# Altium project Guppy Buddy Rev B.PrjPCB (part 8 of 9)

## Sheet Power Main Regulators.SchDoc: Main Regulator
size Tabloid; ApprovedBy: NA; CompanyName: Cospan Design LLC; DrawnBy: Dave McCoy; Engineer: Dave McCoy; DocumentNumber: 20; Revision: A; SheetNumber: 20; SheetTotal: 20; Client: Public; Project: Enigma; ProjectPrettyName: Enigma
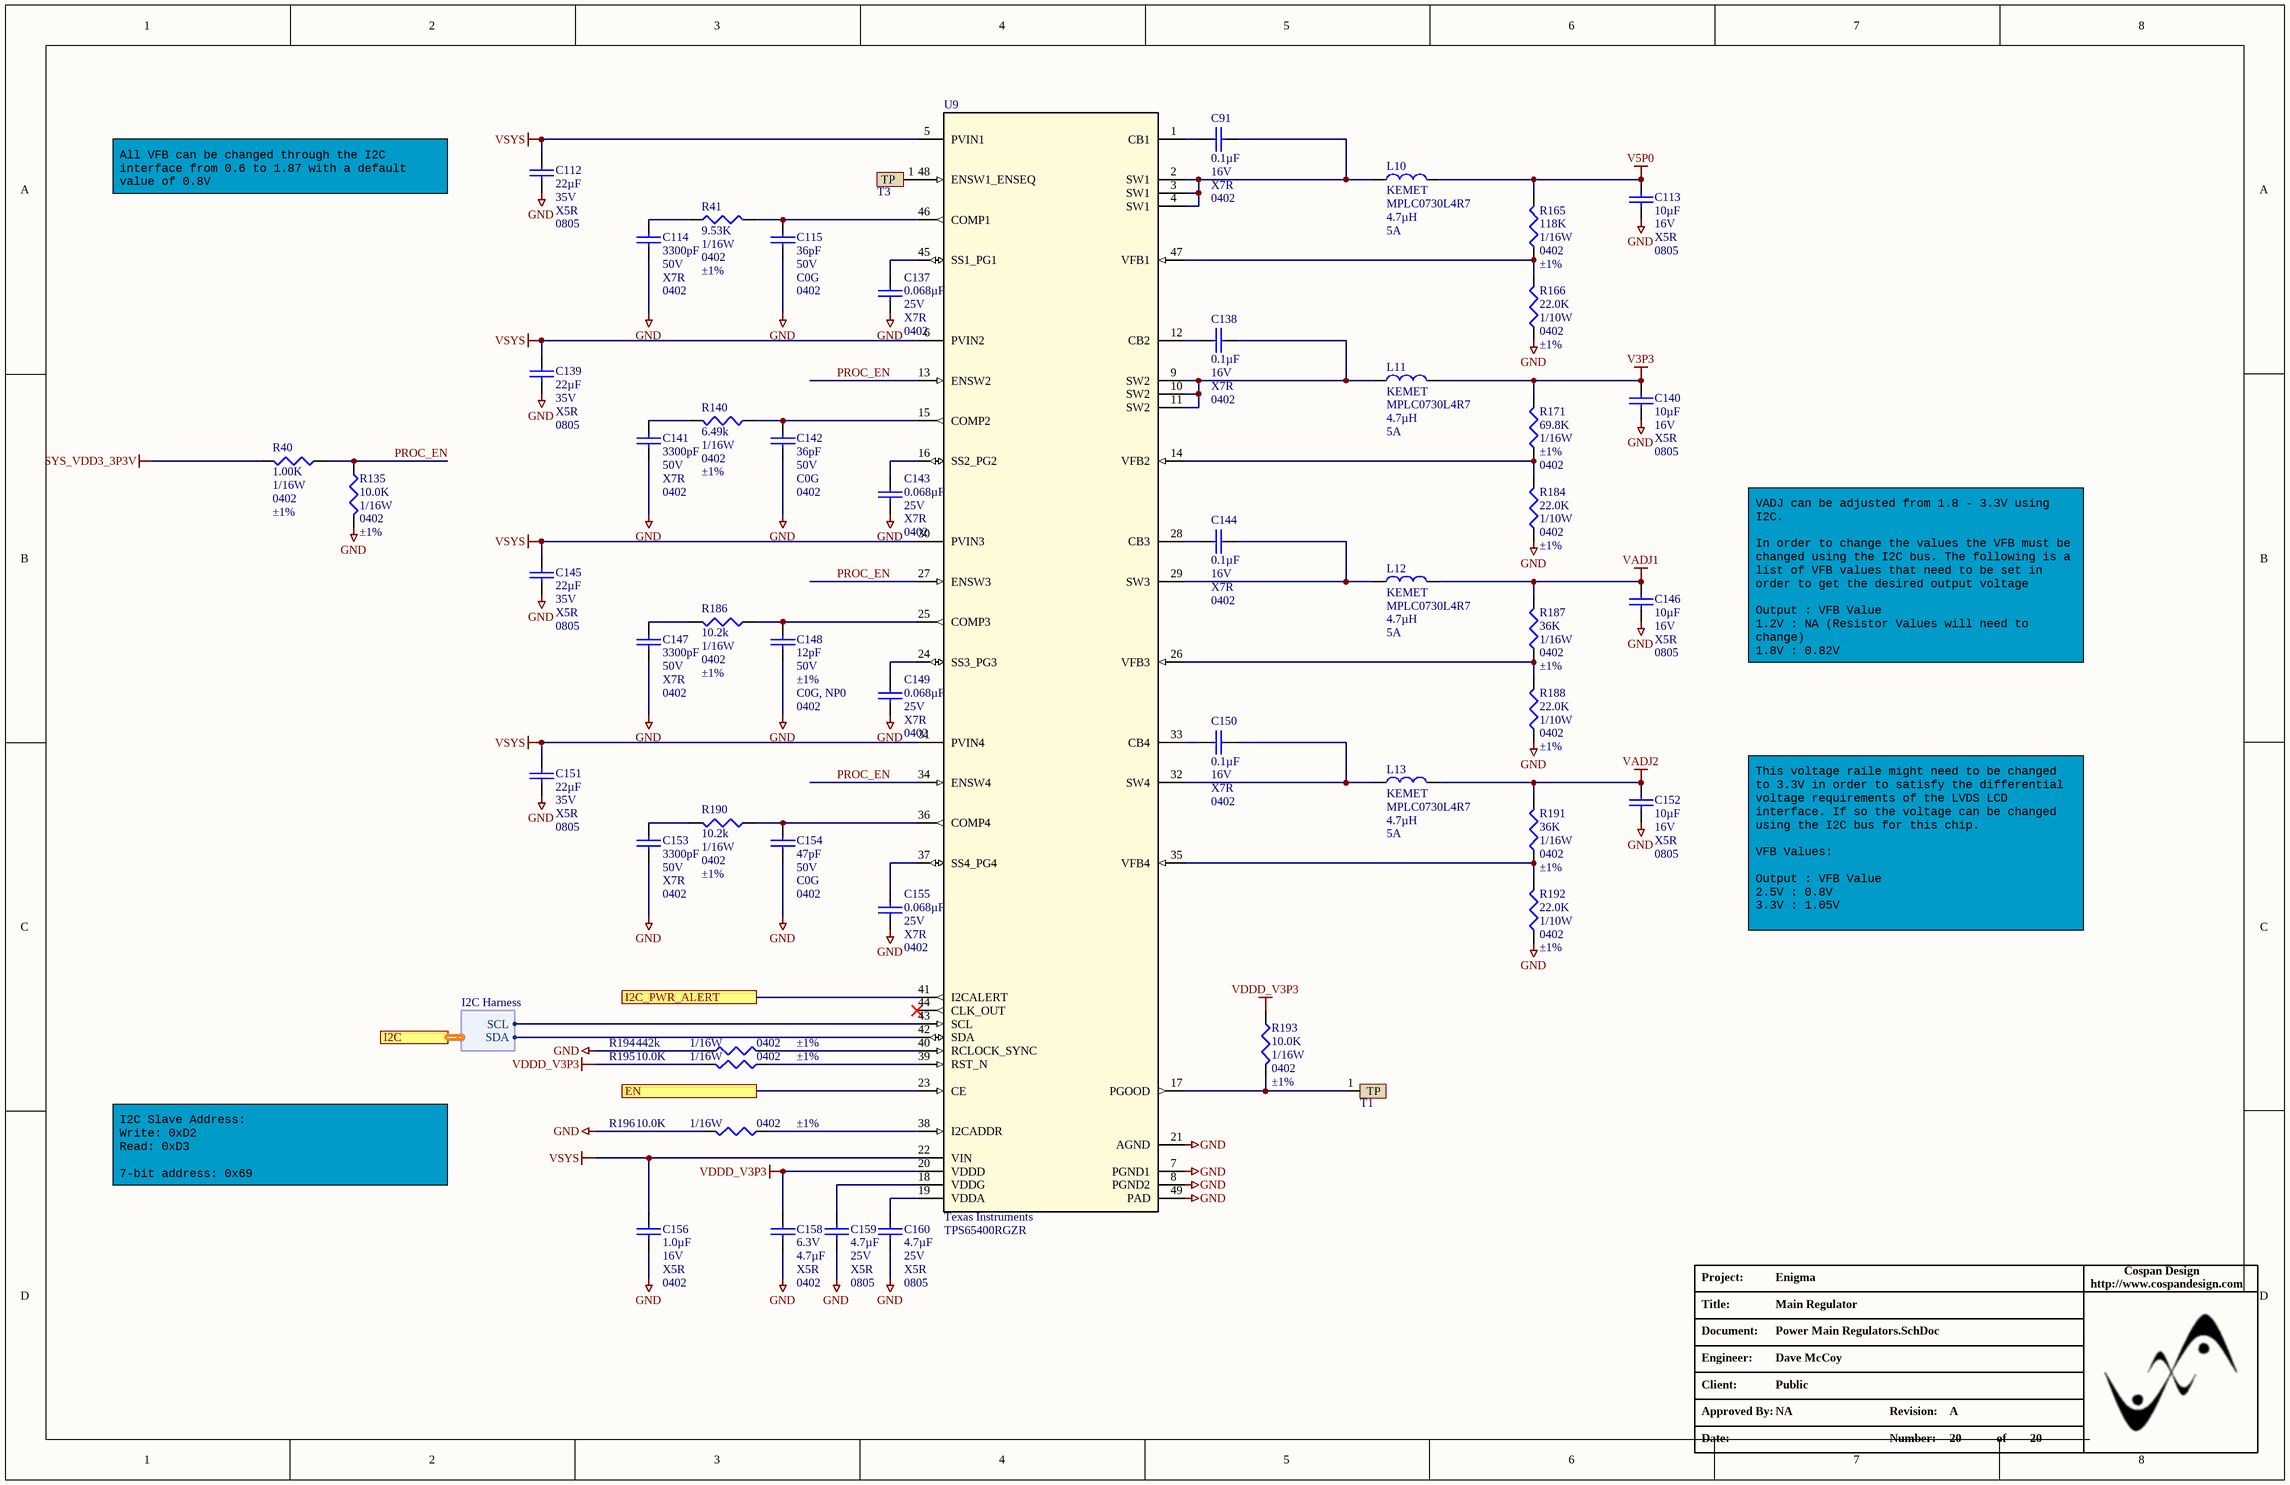
[diagram p14: Power Main Regulators.SchDoc]

### Parts
C91  Capacitance: 0.1µF  Voltage - Rated: 16V  Temperature Coefficient: X7R  Package / Case: 0402  [C_0402]  (hidden comment: 0.1uF)
C112  Capacitance: 22µF  Voltage - Rated: 35V  Temperature Coefficient: X5R  Package / Case: 0805  [C_ERA-0805]  (hidden comment: C_0805_22µF_35V)
C113  Voltage - Rated: 16V  Temperature Coefficient: X5R  Package / Case: 0805  [C_ERA-0805]  (hidden comment: 10µF)
C114  Capacitance: 3300pF  Voltage - Rated: 50V  Temperature Coefficient: X7R  Package / Case: 0402  [C_0402]  (hidden comment: C_0402_3.3nF_50V)
C115  Capacitance: 36pF  Voltage - Rated: 50V  Temperature Coefficient: C0G  Package / Case: 0402  [C_0402]  (hidden comment: C_0402_36pF)
C137  Capacitance: 0.068µF  Voltage - Rated: 25V  Temperature Coefficient: X7R  Package / Case: 0402  [C_0402]  (hidden comment: C_0402_68nF)
C138  Capacitance: 0.1µF  Voltage - Rated: 16V  Temperature Coefficient: X7R  Package / Case: 0402  [C_0402]  (hidden comment: 0.1uF)
C139  Capacitance: 22µF  Voltage - Rated: 35V  Temperature Coefficient: X5R  Package / Case: 0805  [C_ERA-0805]  (hidden comment: C_0805_22µF_35V)
C140  Voltage - Rated: 16V  Temperature Coefficient: X5R  Package / Case: 0805  [C_ERA-0805]  (hidden comment: 10µF)
C141  Capacitance: 3300pF  Voltage - Rated: 50V  Temperature Coefficient: X7R  Package / Case: 0402  [C_0402]  (hidden comment: C_0402_3.3nF_50V)
C142  Capacitance: 36pF  Voltage - Rated: 50V  Temperature Coefficient: C0G  Package / Case: 0402  [C_0402]  (hidden comment: C_0402_36pF)
C143  Capacitance: 0.068µF  Voltage - Rated: 25V  Temperature Coefficient: X7R  Package / Case: 0402  [C_0402]  (hidden comment: C_0402_68nF)
C144  Capacitance: 0.1µF  Voltage - Rated: 16V  Temperature Coefficient: X7R  Package / Case: 0402  [C_0402]  (hidden comment: 0.1uF)
C145  Capacitance: 22µF  Voltage - Rated: 35V  Temperature Coefficient: X5R  Package / Case: 0805  [C_ERA-0805]  (hidden comment: C_0805_22µF_35V)
C146  Voltage - Rated: 16V  Temperature Coefficient: X5R  Package / Case: 0805  [C_ERA-0805]  (hidden comment: 10µF)
C147  Capacitance: 3300pF  Voltage - Rated: 50V  Temperature Coefficient: X7R  Package / Case: 0402  [C_0402]  (hidden comment: C_0402_3.3nF_50V)
C148  Voltage - Rated: 50V  Tolerance: ±1%  Temperature Coefficient: C0G, NP0  Package / Case: 0402  [C_0402]  (hidden comment: 12pF)
C149  Capacitance: 0.068µF  Voltage - Rated: 25V  Temperature Coefficient: X7R  Package / Case: 0402  [C_0402]  (hidden comment: C_0402_68nF)
C150  Capacitance: 0.1µF  Voltage - Rated: 16V  Temperature Coefficient: X7R  Package / Case: 0402  [C_0402]  (hidden comment: 0.1uF)
C151  Capacitance: 22µF  Voltage - Rated: 35V  Temperature Coefficient: X5R  Package / Case: 0805  [C_ERA-0805]  (hidden comment: C_0805_22µF_35V)
C152  Voltage - Rated: 16V  Temperature Coefficient: X5R  Package / Case: 0805  [C_ERA-0805]  (hidden comment: 10µF)
C153  Capacitance: 3300pF  Voltage - Rated: 50V  Temperature Coefficient: X7R  Package / Case: 0402  [C_0402]  (hidden comment: C_0402_3.3nF_50V)
C154  Voltage - Rated: 50V  Temperature Coefficient: C0G  Package / Case: 0402  [C_0402]  (hidden comment: 47pF)
C155  Capacitance: 0.068µF  Voltage - Rated: 25V  Temperature Coefficient: X7R  Package / Case: 0402  [C_0402]  (hidden comment: C_0402_68nF)
C156  Capacitance: 1.0µF  Voltage - Rated: 16V  Temperature Coefficient: X5R  Package / Case: 0402  [C_0402]  (hidden comment: 1.0uF)
C158  Voltage - Rated: 6.3V  Capacitance: 4.7µF  Temperature Coefficient: X5R  Package / Case: 0402  [C_0402]  (hidden comment: 4.7uF)
C159  Voltage - Rated: 25V  Temperature Coefficient: X5R  Package / Case: 0805  [C_ERA-0805]  (hidden comment: 4.7µF)
C160  Voltage - Rated: 25V  Temperature Coefficient: X5R  Package / Case: 0805  [C_ERA-0805]  (hidden comment: 4.7µF)
L10  Manufacturer: KEMET  Manufacturer Part Number: MPLC0730L4R7  Inductance: 4.7µH  Max DC Current: 5A  [KEM_L9004_MPLC]  (hidden comment: L_MPLC0730L4R7)
L11  Manufacturer: KEMET  Manufacturer Part Number: MPLC0730L4R7  Inductance: 4.7µH  Max DC Current: 5A  [KEM_L9004_MPLC]  (hidden comment: L_MPLC0730L4R7)
L12  Manufacturer: KEMET  Manufacturer Part Number: MPLC0730L4R7  Inductance: 4.7µH  Max DC Current: 5A  [KEM_L9004_MPLC]  (hidden comment: L_MPLC0730L4R7)
L13  Manufacturer: KEMET  Manufacturer Part Number: MPLC0730L4R7  Inductance: 4.7µH  Max DC Current: 5A  [KEM_L9004_MPLC]  (hidden comment: L_MPLC0730L4R7)
R40  Resistance In Ohms: 1.00K  Power (Watts): 1/16W  Case: 0402  Tolerance: ±1%  [R_0402]  (hidden comment: 1.0k Ohms)
R41  Resistance In Ohms: 9.53K  Power (Watts): 1/16W  Case: 0402  Tolerance: ±1%  [R_0402]  (hidden comment: R_0402_9.53K)
R135  Resistance In Ohms: 10.0K  Power (Watts): 1/16W  Case: 0402  Tolerance: ±1%  [R_0402]  (hidden comment: R_0402_10.0K)
R140  Resistance In Ohms: 6.49k  Power (Watts): 1/16W  Case: 0402  Tolerance: ±1%  [R_0402]  (hidden comment: R_0402_6.49k)
R165  Resistance In Ohms: 118K  Power (Watts): 1/16W  Case: 0402  Tolerance: ±1%  [R_0402]  (hidden comment: R_0402_118K)
R166  Resistance In Ohms: 22.0K  Power (Watts): 1/10W  Case: 0402  Tolerance: ±1%  [R_0402]  (hidden comment: R_0402_22.0K)
R171  Resistance In Ohms: 69.8K  Power (Watts): 1/16W  Tolerance: ±1%  Case: 0402  [R_0402]  (hidden comment: R_0402_69.8K)
R184  Resistance In Ohms: 22.0K  Power (Watts): 1/10W  Case: 0402  Tolerance: ±1%  [R_0402]  (hidden comment: R_0402_22.0K)
R186  Resistance In Ohms: 10.2k  Power (Watts): 1/16W  Case: 0402  Tolerance: ±1%  [R_0402]  (hidden comment: R_0402_10.2k)
R187  Resistance In Ohms: 36K  Power (Watts): 1/16W  Case: 0402  Tolerance: ±1%  [R_0402]  (hidden comment: R_0402_36.0K)
R188  Resistance In Ohms: 22.0K  Power (Watts): 1/10W  Case: 0402  Tolerance: ±1%  [R_0402]  (hidden comment: R_0402_22.0K)
R190  Resistance In Ohms: 10.2k  Power (Watts): 1/16W  Case: 0402  Tolerance: ±1%  [R_0402]  (hidden comment: R_0402_10.2k)
R191  Resistance In Ohms: 36K  Power (Watts): 1/16W  Case: 0402  Tolerance: ±1%  [R_0402]  (hidden comment: R_0402_36.0K)
R192  Resistance In Ohms: 22.0K  Power (Watts): 1/10W  Case: 0402  Tolerance: ±1%  [R_0402]  (hidden comment: R_0402_22.0K)
R193  Resistance In Ohms: 10.0K  Power (Watts): 1/16W  Case: 0402  Tolerance: ±1%  [R_0402]  (hidden comment: R_0402_10.0K)
R194  Resistance In Ohms: 442k  Power (Watts): 1/16W  Case: 0402  Tolerance: ±1%  [R_0402]  (hidden comment: R_0402_442k)
R195  Resistance In Ohms: 10.0K  Power (Watts): 1/16W  Case: 0402  Tolerance: ±1%  [R_0402]  (hidden comment: R_0402_10.0K)
R196  Resistance In Ohms: 10.0K  Power (Watts): 1/16W  Case: 0402  Tolerance: ±1%  [R_0402]  (hidden comment: R_0402_10.0K)
T1  TEST_POINT_SMALL  [TestPointSmall]  (value not drawn)  (no BOM)
T3  TEST_POINT_SMALL  [TestPointSmall]  (value not drawn)  (no BOM)
U9  Manufacturer: Texas Instruments  Manufacturer Part Number: TPS65400RGZR  [RGZ0048B]  (hidden comment: U_TPS65400RGZR)

### Ports
EN, I2C (harness I2C Harness), I2C_PWR_ALERT

### Harnesses
I2C Harness: SCL, SDA

### Nets
GND: C112.1 C113.1 C114.1 C115.1 C137.1 C139.1 C140.1 C141.1 C142.1 C143.1 C145.1 C146.1 C147.1 C148.1 C149.1 C151.1 C152.1 C153.1 C154.1 C155.1 C156.1 C158.1 C159.1 C160.1 R135.1 R166.2 R184.2 R188.2 R192.2 R194.2 R196.1 U9.7(PGND1) U9.8(PGND2) U9.21(AGND) U9.49(PAD)
SYS_VDD3_3P3V: R40.1
V3P3: C140.2 L11.1 R171.1
V5P0: C113.2 L10.1 R165.1
VADJ1: C146.2 L12.1 R187.1
VADJ2: C152.2 L13.1 R191.1
VDDD_V3P3: C158.2 R193.2 R195.1 U9.20(VDDD)
VSYS: C112.2 C139.2 C145.2 C151.2 C156.2 U9.5(PVIN1) U9.6(PVIN2) U9.22(VIN) U9.30(PVIN3) U9.31(PVIN4)
I2C1_SCL: U9.43(SCL) ; port I2C.SCL
I2C1_SDA: U9.42(SDA) ; port I2C.SDA
I2C_PWR_ALERT: U9.41(I2CALERT) ; port I2C_PWR_ALERT
PROC_EN: R40.2 R135.2 U9.13(ENSW2) U9.27(ENSW3) U9.34(ENSW4)
PWR_ON: U9.23(CE) ; port EN
NetC91_1: C91.1 L10.2 U9.2(SW1) U9.3(SW1) U9.4(SW1)
NetC91_2: C91.2 U9.1(CB1)
NetC114_2: C114.2 R41.2
NetC115_2: C115.2 R41.1 U9.46(COMP1)
NetC137_2: C137.2 U9.45(SS1_PG1)
NetC138_1: C138.1 L11.2 U9.9(SW2) U9.10(SW2) U9.11(SW2)
NetC138_2: C138.2 U9.12(CB2)
NetC141_2: C141.2 R140.1
NetC142_2: C142.2 R140.2 U9.15(COMP2)
NetC143_2: C143.2 U9.16(SS2_PG2)
NetC144_1: C144.1 L12.2 U9.29(SW3)
NetC144_2: C144.2 U9.28(CB3)
NetC147_2: C147.2 R186.1
NetC148_2: C148.2 R186.2 U9.25(COMP3)
NetC149_2: C149.2 U9.24(SS3_PG3)
NetC150_1: C150.1 L13.2 U9.32(SW4)
NetC150_2: C150.2 U9.33(CB4)
NetC153_2: C153.2 R190.1
NetC154_2: C154.2 R190.2 U9.36(COMP4)
NetC155_2: C155.2 U9.37(SS4_PG4)
NetC159_2: C159.2 U9.18(VDDG)
NetC160_2: C160.2 U9.19(VDDA)
NetR165_2: R165.2 R166.1 U9.47(VFB1)
NetR171_2: R171.2 R184.1 U9.14(VFB2)
NetR187_2: R187.2 R188.1 U9.26(VFB3)
NetR191_2: R191.2 R192.1 U9.35(VFB4)
NetR193_1: R193.1 T1.1(TP) U9.17(PGOOD)
NetR194_1: R194.1 U9.40(RCLOCK_SYNC)
NetR195_2: R195.2 U9.39(RST_N)
NetR196_2: R196.2 U9.38(I2CADDR)
NetT3_1: T3.1(TP) U9.48(ENSW1_ENSEQ)

Not connected (* = marked no-connect by the designer): U9 44(CLK_OUT)*

### Notes on the sheet
- All VFB can be changed through the I2C interface from 0.6 to 1.87 with a default value of 0.8V
- VADJ can be adjusted from 1.8 - 3.3V using I2C.
  In order to change the values the VFB must be changed using the I2C bus. The following is a list of VFB values that need to be set in order to get the desired output voltage
  Output	: VFB Value
  1.2V	: NA (Resistor Values will need to change)
  1.8V	: 0.82V
  2.5V	: 1.14V
  3.3V	: 1.51V
- This voltage raile might need to be changed to 3.3V in order to satisfy the differential voltage requirements of the LVDS LCD interface. If so the voltage can be changed using the I2C bus for this chip.
  VFB Values:
  Output	: VFB Value
  2.5V	: 0.8V
  3.3V	: 1.05V
- I2C Slave Address:
  Write: 0xD2
  Read: 0xD3
  7-bit address: 0x69
- Project:
- http://www.cospandesign.com
- Cospan Design
- Document:
- Engineer:
- Title:
- Client:
- Approved By:
- Revision:
- Date:
- Number:
- of

### Library data of the parts
C91 C138 C144 C150 = C_0402_0.1UF_16V: CAP CER .10UF 16V X7R 0402; Manufacturer: Murata Electronics North America; Manufacturer Part Number: GRM155R71C104KA88J; Tolerance: ±10%; Supplier 1: Digi-Key; RoHS: RoHS Compliant; Category: Capacitors; Stock 1: 18103134; Pricing 1: 1=0.1, 10=0.014, 100=0.0062, 500=0.00442, 1000=0.00348, 2500=0.00316, 5000=0.00291 (USD); Packaging: Cut Tape (CT); Part Status: Active; Operating Temperature: -55°C ~ 125°C; Features: -; Ratings: -; Applications: General Purpose; Mounting Type: Surface Mount, MLCC; Size / Dimension: 0.039" L x 0.020" W (1.00mm x 0.50mm); Height - Seated (Max): -; Thickness (Max): 0.022" (0.55mm); Lead Spacing: -; ComponentLink1URL: http://www.murata.com/~/media/webrenewal/support/library/catalog/products/capacitor/mlcc/c02e.ashx?la=en-us; ComponentLink1Description: http://www.murata.com/~/media/webrenewal/support/library/catalog/products/capacitor/mlcc/c02e.ashx?la=en-us; Supplier Part Number 1: 490-6328-1-ND
C112 C139 C145 C151 = C_0805_22µF_35V: CAP CER 22UF 35V X5R 0805; Manufacturer: TDK Corporation; Manufacturer Part Number: C2012X5R1V226M125AC; Tolerance: ±20%; Supplier 1: Digi-Key; RoHS: RoHS Compliant; Category: Capacitors; Stock 1: 3681; Pricing 1: 1=1.14, 10=0.863, 100=0.6176, 500=0.47818, 1000=0.41176 (USD); Packaging: Cut Tape (CT); Mounting Type: Surface Mount, MLCC; Operating Temperature: -55°C ~ 85°C; Applications: General Purpose; Ratings: -; Size / Dimension: 0.079" L x 0.049" W (2.00mm x 1.25mm); Height - Seated (Max): -; Thickness (Max): 0.057" (1.45mm); Lead Spacing: -; Features: Low ESL; Lead Style: -; ComponentLink1URL: https://product.tdk.com/info/en/catalog/datasheets/mlcc_commercial_general_en.pdf; ComponentLink1Description: https://product.tdk.com/info/en/catalog/datasheets/mlcc_commercial_general_en.pdf; Supplier Part Number 1: 445-14428-1-ND; Part Status: Active; Failure Rate: -
C113 C140 C146 C152 = C_0805_10UF_16V: CAP CER 10uF 16V X5R 20% 0805; Manufacturer: Taiyo Yuden; Manufacturer Part Number: EMK212BJ106KG-T; Tolerance: ±10%; Supplier 1: Digi-Key; Supplier Part Number 1: 587-1295-1-ND; Category: Capacitors; Stock 1: 2052124; Capacitance: 10µF; RoHS: RoHS Compliant; Pricing 1: 1=0.2, 10=0.139, 100=0.0656, 500=0.04596, 1000=0.03805 (USD); Packaging: Cut Tape (CT); Part Status: Active; Operating Temperature: -55°C ~ 85°C; Features: -; Ratings: -; Applications: General Purpose; Mounting Type: Surface Mount, MLCC; Size / Dimension: 0.079" L x 0.049" W (2.00mm x 1.25mm); Height - Seated (Max): -; Thickness (Max): 0.053" (1.35mm); Lead Spacing: -; Lead Style: -; ComponentLink1URL: http://www.yuden.co.jp/productdata/catalog/en/mlcc01_e.pdf; ComponentLink1Description: http://www.yuden.co.jp/productdata/catalog/en/mlcc01_e.pdf
C114 C141 C147 C153 = C_0402_3.3nF_50V: Manufacturer: Murata Electronics North America; Manufacturer Part Number: GRM155R71H332KA01D; Tolerance: ±10%; Supplier 1: Digi-Key; Supplier Part Number 1: 490-3248-1-ND; RoHS: RoHS Compliant; Category: Capacitors; Stock 1: 717319; Mounting Type: Surface Mount, MLCC; Operating Temperature: -55°C ~ 125°C; Applications: General Purpose; Size / Dimension: 0.039" L x 0.020" W (1.00mm x 0.50mm); Thickness (Max): 0.022" (0.55mm); Packaging: Cut Tape (CT); ComponentLink1URL: http://www.murata.com/~/media/webrenewal/support/library/catalog/products/capacitor/mlcc/c02e.ashx?la=en-us; ComponentLink1Description: http://www.murata.com/~/media/webrenewal/support/library/catalog/products/capacitor/mlcc/c02e.ashx?la=en-us; Pricing 1: 1=0.1, 10=0.013, 100=0.0059, 500=0.0042, 1000=0.0033, 2500=0.003, 5000=0.00276 (USD); Part Status: Active; Features: -; Ratings: -; Height - Seated (Max): -; Lead Spacing: -; Lead Style: -
C115 C142 = C_0402_36pF: CAP CER 36PF 50V NP0 0402; Manufacturer: Samsung Electro-Mechanics America, Inc.; Manufacturer Part Number: CL05C360JB5NNNC; Tolerance: ±5%; Supplier 1: Digi-Key; RoHS: RoHS Compliant; Category: Capacitors; Stock 1: 24626; Pricing 1: 1=0.1, 10=0.03, 25=0.0208, 50=0.016, 100=0.0135, 500=0.00948, 1000=0.00738, 5000=0.00615 (USD); Packaging: Cut Tape (CT); Mounting Type: Surface Mount, MLCC; Operating Temperature: -55°C ~ 125°C; Applications: General Purpose; Ratings: -; Size / Dimension: 0.039" L x 0.020" W (1.00mm x 0.50mm); Height - Seated (Max): -; Thickness (Max): 0.022" (0.55mm); Lead Spacing: -; Features: -; Lead Style: -; ComponentLink1URL: http://www.samsungsem.com/kr/support/product-search/mlcc/CL05C360JB5NNNC.jsp; ComponentLink1Description: http://www.samsungsem.com/kr/support/product-search/mlcc/CL05C360JB5NNNC.jsp; Supplier Part Number 1: 1276-1686-1-ND
C137 C143 C149 C155 = C_0402_68nF: CAP CER 0.068UF 25V X7R 0402; Manufacturer: Murata Electronics North America; Manufacturer Part Number: GRM155R71E683KE14D; Tolerance: ±10%; Supplier 1: Digi-Key; RoHS: RoHS Compliant; Category: Capacitors; Stock 1: 7620; Pricing 1: 1=0.1, 10=0.031, 100=0.0136, 500=0.00974, 1000=0.00765, 2500=0.00696, 5000=0.0064 (USD); Packaging: Cut Tape (CT); Part Status: Active; Operating Temperature: -55°C ~ 125°C; Features: -; Ratings: -; Applications: General Purpose; Failure Rate: -; Mounting Type: Surface Mount, MLCC; Size / Dimension: 0.039" L x 0.020" W (1.00mm x 0.50mm); Height - Seated (Max): -; Thickness (Max): 0.022" (0.55mm); Lead Spacing: -; Lead Style: -; ComponentLink1URL: http://search.murata.co.jp/Ceramy/image/img/A01X/G101/ENG/GRM155R71E683KE14-01.pdf; ComponentLink1Description: http://search.murata.co.jp/Ceramy/image/img/A01X/G101/ENG/GRM155R71E683KE14-01.pdf; Supplier Part Number 1: 490-14604-1-ND
C148 = C_0402_12PF_50V: CAP CER 12PF 50V 5% C0G 0402; Manufacturer: Murata Electronics North America; Manufacturer Part Number: GRM1555C1H120FA01D; Supplier 1: Digi-Key; Supplier Part Number 1: 490-6196-1-ND; RoHS: RoHS Compliant; Category: Capacitors; Stock 1: 386052; Mounting Type: Surface Mount, MLCC; Operating Temperature: -55°C ~ 125°C; Applications: General Purpose; Ratings: -; Size / Dimension: 0.039" L x 0.020" W (1.00mm x 0.50mm); Lead Spacing: -; Features: -; Packaging: Cut Tape (CT); Lead Style: -; ComponentLink1URL: http://search.murata.co.jp/Ceramy/image/img/A01X/G101/ENG/GRM1555C1H120FA01-01.pdf; ComponentLink1Description: http://search.murata.co.jp/Ceramy/image/img/A01X/G101/ENG/GRM1555C1H120FA01-01.pdf; Capacitance: 12pF; Pricing 1: 1=0.1, 10=0.05, 100=0.0223, 500=0.01594, 1000=0.01252, 2500=0.01138, 5000=0.01047 (USD); Part Status: Active; Height - Seated (Max): -; Thickness (Max): 0.022" (0.55mm)
C154 = C_0402_47p_50V: CAP CER 47PF 50V 5% C0G 0402; Manufacturer: Murata Electronics North America; Manufacturer Part Number: GRM1555C1H470JA01D; Supplier 1: Digi-Key; RoHS: RoHS Compliant; Category: Capacitors; Stock 1: 682755; Pricing 1: 1=0.1, 10=0.013, 50=0.007, 100=0.0059, 250=0.00488, 500=0.00416, 1000=0.00324, 5000=0.0027 (USD); Packaging: Cut Tape (CT); Tolerance: ±5%; Mounting Type: Surface Mount, MLCC; Operating Temperature: -55°C ~ 125°C; Applications: General Purpose; Ratings: -; Size / Dimension: 0.039" L x 0.020" W (1.00mm x 0.50mm); Height - Seated (Max): -; Thickness (Max): 0.022" (0.55mm); Lead Spacing: -; Features: -; Lead Style: -; ComponentLink1URL: http://www.murata.com/~/media/webrenewal/support/library/catalog/products/capacitor/mlcc/c02e.ashx; ComponentLink1Description: http://www.murata.com/~/media/webrenewal/support/library/catalog/products/capacitor/mlcc/c02e.ashx; Supplier Part Number 1: 490-5942-1-ND; Capacitance: 47pF
C156 = C_0402_1.0UF_16V: CAP CER 1.0UF 16V X5R 0402; Manufacturer 1: Samsung; Manufacturer Part Number 1: CL05A105KO5NNNC; Description 1: Cap Ceramic 1uF 16V X5R 10% SMD 0402 85C Paper T/R; Tolerance: 10%; ComponentLink1URL: http://ds.yuden.co.jp/TYCOMPAS/ut/detail.do?productNo=EMK105BJ105KV-F&fileName=EMK105BJ105KV-F_SS&mode=specSheetDownload; ComponentLink1Description: http://ds.yuden.co.jp/TYCOMPAS/ut/detail.do?productNo=EMK105BJ105KV-F&fileName=EMK105BJ105KV-F_SS&mode=specSheetDownload; ComponentLink2URL: https://datasheet.ciiva.com/16207/cl05a105ko5nnnc-16207571.pdf; ComponentLink2Description: https://datasheet.ciiva.com/16207/cl05a105ko5nnnc-16207571.pdf; ComponentLink3URL: https://datasheet.ciiva.com/15195/getdatasheetpartid-355272-15195629.pdf; ComponentLink3Description: https://datasheet.ciiva.com/15195/getdatasheetpartid-355272-15195629.pdf; Supplier 1: Digi-Key; Supplier Part Number 1: 1276-1067-6-ND; Stock 1: 26908; Pricing 1: 1=0.1, 10=0.062, 100=0.0276, 500=0.01968, 1000=0.01547, 2500=0.01406, 5000=0.01294 (USD); Mount: Surface Mount; Case/Package: 0402; Case Code (Metric): 1005; Case Code (Imperial): 0402; Contact Plating: Tin; Min Operating Temperature: -55°C; Max Operating Temperature: 85°C; Dielectric: X5R; Packaging: Tape and Reel; Package Quantity: 1; Voltage Rating: 16V; Voltage: 16V; Length: 1mm; Height: 0.5mm; Width: 0.02inch; Thickness: 0.022inch; Depth: 0.5mm; Radiation Hardening: No
C158 = C_0402_4.7UF: CAP CER 4.7UF 6.3V X5R 0402; Manufacturer: Samsung Electro-Mechanics America, Inc; Manufacturer Part Number: CL05A475MQ5NRNC; Tolerance: ±20%; Supplier 1: Digi-Key; Supplier Part Number 1: 1276-1056-1-ND; RoHS: RoHS Compliant; Category: Capacitors; Stock 1: 318619; Pricing: 1=0.23, 10=0.159, 25=0.116, 50=0.0966, 100=0.0811, 250=0.06564, 500=0.0579, 1000=0.04922, 2500=0.04536 (USD); Packaging: Cut Tape (CT); Mounting Type: Surface Mount, MLCC; Operating Temperature: -55°C ~ 85°C; Applications: General Purpose; Ratings: -; Size / Dimension: 0.039" L x 0.020" W (1.00mm x 0.50mm); Height - Seated (Max): -; Thickness (Max): 0.022" (0.55mm); Lead Spacing: -; Features: -; Lead Style: -; ComponentLink1URL: http://www.samsungsem.com/servlet/FileDownload?type=spec&file=CL05A475MQ5NRNC.pdf; ComponentLink1Description: http://www.samsungsem.com/servlet/FileDownload?type=spec&file=CL05A475MQ5NRNC.pdf
C159 C160 = C_0805_4.7µF_25V: CAP CER 4.7UF 25V 10% X5R 0805; Manufacturer: Taiyo Yuden; Manufacturer Part Number: TMK212BJ475KG-T; Supplier 1: Digi-Key; RoHS: RoHS Compliant; Category: Capacitors; Stock 1: 38955; Pricing 1: 1=0.24, 10=0.2, 50=0.1126, 100=0.1, 250=0.075, 500=0.06626, 1000=0.05875 (USD); Tolerance: ±10%; Mounting Type: Surface Mount, MLCC; Operating Temperature: -55°C ~ 85°C; Applications: General Purpose; Ratings: -; Size / Dimension: 0.079" L x 0.049" W (2.00mm x 1.25mm); Height - Seated (Max): -; Thickness (Max): 0.053" (1.35mm); Lead Spacing: -; Features: -; Packaging: Cut Tape (CT); Lead Style: -; ComponentLink1URL: http://www.yuden.co.jp/productdata/catalog/en/mlcc01_e.pdf; ComponentLink1Description: http://www.yuden.co.jp/productdata/catalog/en/mlcc01_e.pdf; Supplier Part Number 1: 587-1782-1-ND; Capacitance: 4.7µF
L10-L13 = L_MPLC0730L4R7: FIXED IND 4.7UH 5A 41 MOHM SMD; Type: Wirewound; Tolerance: ±20%; Shielding: Shielded; DC Resistance (DCR): 41 mOhm Max; Supplier 1: Digi-Key; RoHS: RoHS Compliant; Category: Inductors, Coils, Chokes; Stock 1: 3443; Pricing 1: 1=0.9, 10=0.837, 25=0.7728, 50=0.644, 100=0.6054, 250=0.54096, 500=0.46368 (USD); Packaging: Cut Tape (CT); Part Status: Active; Material - Core: -; Q @ Freq: -; Ratings: -; Operating Temperature: -20°C ~ 120°C; Mounting Type: Surface Mount; Package / Case: 2-SMD, J-Lead; Supplier Device Package: -; Size / Dimension: 0.303" L x 0.264" W (7.70mm x 6.70mm); Height - Seated (Max): 0.118" (3.00mm); ComponentLink1URL: https://search.kemet.com/component-edge/download/datasheet/MPLC0730L4R7.pdf; ComponentLink1Description: https://search.kemet.com/component-edge/download/datasheet/MPLC0730L4R7.pdf; Supplier Part Number 1: 399-10992-1-ND
R40 = R_0402_1.0K: RES 1.00K OHM 1/16W 1% 0402 SMD; Manufacturer: Yageo; Manufacturer Part Number: RC0402FR-071KL; Resistance (Ohms): 1K; Temperature Coefficient: ±100ppm/°C; Supplier 1: Digi-Key; Supplier Part Number 1: 311-1.00KLRCT-ND; RoHS: RoHS Compliant; Category: Resistors; Stock 1: 2103351; Pricing: 10=0.014, 100=0.0063, 500=0.00382, 1000=0.0027, 5000=0.00203 (USD); Composition: Thick Film; Features: -; Package / Case: 0402 (1005 Metric); Size / Dimension: 0.039" L x 0.020" W (1.00mm x 0.50mm); Height: 0.016" (0.40mm); Number of Terminations: 2; Packaging: Cut Tape (CT); ComponentLink1URL: http://www.yageo.com/documents/recent/PYu-RC0402_51_RoHS_L_6.pdf; ComponentLink1Description: http://www.yageo.com/documents/recent/PYu-RC0402_51_RoHS_L_6.pdf
R41 = R_0402_9.53K: RES SMD 9.53K OHM 1% 1/16W 0402; Manufacturer: Yageo; Manufacturer Part Number: RC0402FR-079K53L; Temperature Coefficient: ±100ppm/°C; Supplier 1: Digi-Key; RoHS: RoHS Compliant; Category: Resistors; Stock 1: 234095; Pricing 1: 1=0.1, 10=0.013, 25=0.0096, 100=0.0054, 250=0.00412, 500=0.00328, 1000=0.00242, 2500=0.0021, 5000=0.00173 (USD); Packaging: Cut Tape (CT); Part Status: Active; Resistance (Ohms): 9.53k; Composition: Thick Film; Features: Moisture Resistant; Operating Temperature: -55°C ~ 155°C; Package / Case: 0402 (1005 Metric); Supplier Device Package: 0402; Size / Dimension: 0.039" L x 0.020" W (1.00mm x 0.50mm); Height: 0.016" (0.40mm); Number of Terminations: 2; ComponentLink1URL: http://www.yageo.com/documents/recent/PYu-RC_Group_51_RoHS_L_04.pdf; ComponentLink1Description: http://www.yageo.com/documents/recent/PYu-RC_Group_51_RoHS_L_04.pdf; Supplier Part Number 1: 311-9.53KLRCT-ND
R135 R193 R195 R196 = R_0402_10.0K: as R104-R106 on sheet LCD; Supplier 1: Digi-Key; Supplier Part Number 1: RMCF0402FT10K0CT-ND; RoHS: RoHS Compliant; Category: Resistors; Stock 1: 234525; Pricing: 1=0.04, 10=0.025, 50=0.0138, 100=0.0105, 250=0.0078, 500=0.00576, 1000=0.00384, 2500=0.00324, 5000=0.0027 (USD); Composition: Thick Film; Features: -; Package / Case: 0402 (1005 Metric); Size / Dimension: 0.039" L x 0.020" W (1.00mm x 0.50mm); Height: 0.016" (0.40mm); Number of Terminations: 2; Packaging: Cut Tape (CT); ComponentLink1URL: http://www.seielect.com/Catalog/SEI-RMCF_RMCP.pdf; ComponentLink1Description: http://www.seielect.com/Catalog/SEI-RMCF_RMCP.pdf
R140 = R_0402_6.49k: RES SMD 6.49K OHM 1% 1/16W 0402; Manufacturer: Samsung Electro-Mechanics America, Inc.; Manufacturer Part Number: RC1005F6491CS; Temperature Coefficient: ±100ppm/°C; Supplier 1: Digi-Key; RoHS: RoHS Compliant; Category: Resistors; Stock 1: 45311; Pricing 1: 1=0.1, 10=0.013, 25=0.0096, 50=0.0074, 100=0.0054, 250=0.00412, 500=0.00328, 1000=0.00242, 2500=0.0021 (USD); Packaging: Cut Tape (CT); Resistance (Ohms): 6.49k; Composition: Thick Film; Features: -; Operating Temperature: -55°C ~ 155°C; Package / Case: 0402 (1005 Metric); Supplier Device Package: 0402 (1005 Metric); Size / Dimension: 0.039" L x 0.020" W (1.00mm x 0.50mm); Height: 0.016" (0.40mm); Number of Terminations: 2; ComponentLink1URL: http://media.digikey.com/pdf/Data%20Sheets/Samsung%20PDFs/RC_Series_ds.pdf; ComponentLink1Description: http://media.digikey.com/pdf/Data%20Sheets/Samsung%20PDFs/RC_Series_ds.pdf; Supplier Part Number 1: 1276-4096-1-ND
R165 = R_0402_118K: RES SMD 118K OHM 1% 1/16W 0402; Manufacturer: Stackpole Electronics Inc; Manufacturer Part Number: RMCF0402FT118K; Temperature Coefficient: ±100ppm/°C; Supplier 1: Digi-Key; RoHS: RoHS Compliant; Category: Resistors; Stock 1: 43108; Pricing 1: 1=0.1, 10=0.025, 50=0.0138, 100=0.0105, 250=0.0078, 500=0.00576, 1000=0.00384, 2500=0.00324, 5000=0.0027 (USD); Packaging: Cut Tape (CT); Resistance (Ohms): 118k; Composition: Thick Film; Features: Automotive AEC-Q200; Operating Temperature: -55°C ~ 155°C; Package / Case: 0402 (1005 Metric); Supplier Device Package: 0402; Size / Dimension: 0.039" L x 0.020" W (1.00mm x 0.50mm); Height: 0.016" (0.40mm); Number of Terminations: 2; ComponentLink1URL: http://www.seielect.com/Catalog/SEI-RMCF_RMCP.pdf; ComponentLink1Description: http://www.seielect.com/Catalog/SEI-RMCF_RMCP.pdf; Supplier Part Number 1: RMCF0402FT118KCT-ND
R166 R184 R188 R192 = R_0402_22.0K: RES 22.0K OHM 1/10W 1% 0402 SMD; Manufacturer: Vishay Dale; Manufacturer Part Number: CRCW040222K0FKED; Resistance (Ohms): 22k; Temperature Coefficient: ±100ppm/°C; Supplier 1: Digi-Key; Supplier Part Number 1: 541-22.0KLCT-ND; RoHS: RoHS Compliant; Category: Resistors; Stock 1: 15892; Pricing: 10=0.083, 50=0.0444, 200=0.0255, 1000=0.0174 (USD); Composition: Thick Film; Features: -; Package / Case: 0402 (1005 Metric); Size / Dimension: 0.039" L x 0.020" W (1.00mm x 0.50mm); Height: 0.016" (0.40mm); Number of Terminations: 2; Packaging: Cut Tape (CT); ComponentLink1URL: http://www.vishay.com/doc?20035; ComponentLink1Description: http://www.vishay.com/doc?20035
R171 = R_0402_69.8K: RES 69.8K OHM 1/16W 1% 0402 SMD; Manufacturer: Yageo; Manufacturer Part Number: RC0402FR-0769K8L; Temperature Coefficient: ±100ppm/°C; Supplier 1: Digi-Key; Supplier Part Number 1: YAG3216CT-ND; RoHS: RoHS Compliant; Category: Resistors; Stock 1: 160383; Composition: Thick Film; Features: Moisture Resistant; Package / Case: 0402 (1005 Metric); Size / Dimension: 0.039" L x 0.020" W (1.00mm x 0.50mm); Packaging: Cut Tape (CT); ComponentLink1URL: http://www.yageo.com/documents/recent/PYu-RC_Group_51_RoHS_L_7.pdf; ComponentLink1Description: http://www.yageo.com/documents/recent/PYu-RC_Group_51_RoHS_L_7.pdf; Pricing 1: 1=0.1, 10=0.014, 100=0.0055, 1000=0.00247, 2500=0.00214, 5000=0.00177 (USD); Part Status: Active; Operating Temperature: -55°C ~ 155°C; Supplier Device Package: 0402; Height - Seated (Max): 0.016" (0.40mm); Failure Rate: -
R186 R190 = R_0402_10.2k: RES SMD 10.2K OHM 1% 1/16W 0402; Manufacturer: Stackpole Electronics Inc.; Manufacturer Part Number: RMCF0402FT10K2; Temperature Coefficient: ±100ppm/°C; Supplier 1: Digi-Key; RoHS: RoHS Compliant; Category: Resistors; Stock 1: 69477; Pricing 1: 1=0.1, 10=0.019, 50=0.0106, 100=0.0078, 250=0.00596, 500=0.00476, 1000=0.0035, 2500=0.00304, 5000=0.00251 (USD); Packaging: Cut Tape (CT); Resistance (Ohms): 10.2k; Composition: Thick Film; Features: Automotive AEC-Q200; Operating Temperature: -55°C ~ 155°C; Package / Case: 0402 (1005 Metric); Supplier Device Package: 0402; Size / Dimension: 0.039" L x 0.020" W (1.00mm x 0.50mm); Height: 0.016" (0.40mm); Number of Terminations: 2; ComponentLink1URL: http://www.seielect.com/Catalog/SEI-RMCF_RMCP.pdf; ComponentLink1Description: http://www.seielect.com/Catalog/SEI-RMCF_RMCP.pdf; Supplier Part Number 1: RMCF0402FT10K2CT-ND
R187 R191 = R_0402_36.0K: RES 36.0K OHM 1/10W 1% 0402 SMD; Manufacturer: Panasonic - ECG; Manufacturer Part Number: ERJ-2RKF3602X; Temperature Coefficient: ±100ppm/°C; Supplier 1: Digi-Key; Supplier Part Number 1: P36.0KLCT-ND; RoHS: RoHS Compliant; Category: Resistors; Stock 1: 39656; Pricing: 1=0.06, 50=0.0242, 100=0.0184, 250=0.01364, 500=0.01008, 1000=0.00672, 5000=0.00473 (USD); Resistance (Ohms): 36K; Composition: Thick Film; Features: -; Size / Dimension: 0.039" L x 0.020" W (1.00mm x 0.50mm); Height: 0.016" (0.40mm); Number of Terminations: 2; Packaging: Cut Tape (CT); Package / Case: 0402 (1005 Metric); ComponentLink1URL: http://industrial.panasonic.com/www-cgi/jvcr13pz.cgi?E+PZ+3+AOA0002+ERJ2RKF3602X+7+WW; ComponentLink1Description: http://industrial.panasonic.com/www-cgi/jvcr13pz.cgi?E+PZ+3+AOA0002+ERJ2RKF3602X+7+WW
R194 = R_0402_442k: RES SMD 442K OHM 1% 1/16W 0402; Manufacturer: Yageo; Manufacturer Part Number: RC0402FR-07442KL; Temperature Coefficient: ±100ppm/°C; Supplier 1: Digi-Key; Stock 1: 113995; Pricing 1: 1=0.1, 10=0.014, 100=0.0056, 1000=0.00253, 2500=0.0022, 5000=0.00181 (USD); Packaging: Cut Tape (CT); Composition: Thick Film; ComponentLink1URL: http://www.yageo.com/documents/recent/PYu-RC_Group_51_RoHS_L_7.pdf; ComponentLink1Description: http://www.yageo.com/documents/recent/PYu-RC_Group_51_RoHS_L_7.pdf; Supplier Part Number 1: 311-442KLRCT-ND; RoHS: RoHS Compliant; Category: Resistors; Part Status: Active; Features: Moisture Resistant; Operating Temperature: -55°C ~ 155°C; Package / Case: 0402 (1005 Metric); Supplier Device Package: 0402; Size / Dimension: 0.039" L x 0.020" W (1.00mm x 0.50mm); Height - Seated (Max): 0.016" (0.40mm); Failure Rate: -
T1 T3 = TEST_POINT_SMALL: OSCILLOSCOPE TEST POINT
U9 = U_TPS65400RGZR: IC REG BUCK ADJ 4A/2A QD 48VQFN; Function: Step-Down; Output Configuration: Positive; Output Type: Adjustable; Number of Outputs: 4; Voltage - Input (Min): 4.5V; Voltage - Input (Max): 18V; Voltage - Output (Min/Fixed): 0.6V; Voltage - Output (Max): 16.2V; Current - Output: 4A, 2A; Frequency - Switching: 275kHz ~ 2.2MHz; Synchronous Rectifier: Yes; Application_BuildNumber: *; Supplier 1: Digi-Key; RoHS: RoHS Compliant; Category: Integrated Circuits (ICs); Stock 1: 2343; Pricing 1: 1=5.16, 10=4.633, 100=3.7961, 500=3.23152, 1000=2.72538 (USD); Packaging: Cut Tape (CT); Part Status: Active; Topology: Buck; Operating Temperature: -40°C ~ 125°C (TJ); Mounting Type: Surface Mount; Package / Case: 48-VFQFN Exposed Pad; Supplier Device Package: 48-VQFN (7x7); ComponentLink1URL: http://www.ti.com/lit/ds/symlink/tps65400.pdf; ComponentLink1Description: http://www.ti.com/lit/ds/symlink/tps65400.pdf; Supplier Part Number 1: 296-40902-1-ND

## Sheet Low Speed Expansion.SchDoc: Low Speed Expansion
size Tabloid; ApprovedBy: NA; CompanyName: Cospan Design LLC; DrawnBy: David McCoy; Engineer: David McCoy; DocumentNumber: 9; Revision: A; SheetNumber: 9; SheetTotal: 18; Client: OSH; Project: Guppy Buddy; ProjectPrettyName: Guppy Buddy
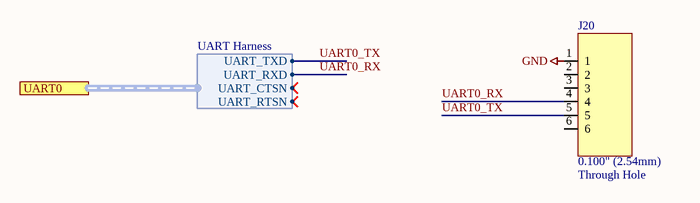
[diagram p15: Low Speed Expansion.SchDoc]

### Parts
J20  Pitch: 0.100" (2.54mm)  Mounting Type: Through Hole  [HDR_1X6 - FEMALE]  (hidden comment: J_HDR1X6_THRHOLE_VERT_FEMALE)

### Ports
UART0 (harness UART Harness)

### Harnesses
UART Harness: UART_TXD, UART_RXD, UART_CTSN, UART_RTSN

### Nets
GND: J20.1
UART0_RX: J20.4 ; port UART0.UART_RXD
UART0_TX: J20.5 ; port UART0.UART_TXD

Not connected (* = marked no-connect by the designer): J20 2 3 6

### Notes on the sheet
- Project:
- http://www.cospandesign.com
- Cospan Design
- Document:
- Engineer:
- Title:
- Client:
- Approved By:
- Revision:
- Date:
- Number:
- of

### Library data of the parts
J20 = J_HDR1X6_THRHOLE_VERT_FEMALE: CONN HEADER FEMALE 6POS .1" TIN; Manufacturer: Samtec; Manufacturer Part Number: SSW-106-01-T-S; Number of Positions: 6; Number of Positions Loaded: All; Supplier 1: Samtec; Supplier Part Number 1: SSW-106-01-T-S; Category: Connectors, Interconnects; Connector Type: Header; Contact Type: Female Socket; Number of Rows: 1; Termination: Solder; Contact Finish: Tin; Contact Finish Thickness: -; Color: Black; ComponentLink1URL: http://www.sullinscorp.com/drawings/101_xPxCxxxLFBN-RC,_10492-D.pdf; ComponentLink1Description: http://www.sullinscorp.com/drawings/101_xPxCxxxLFBN-RC,_10492-D.pdf; Pricing: 0.373

## Sheet FPGA.SchDoc: Cart
size Tabloid; ApprovedBy: NA; CompanyName: Cospan Design LLC; DrawnBy: David McCoy; Engineer: David McCoy; DocumentNumber: 12; Revision: A; SheetNumber: 12; SheetTotal: 18; Client: OSH; Project: Guppy Buddy; ProjectPrettyName: Guppy Buddy
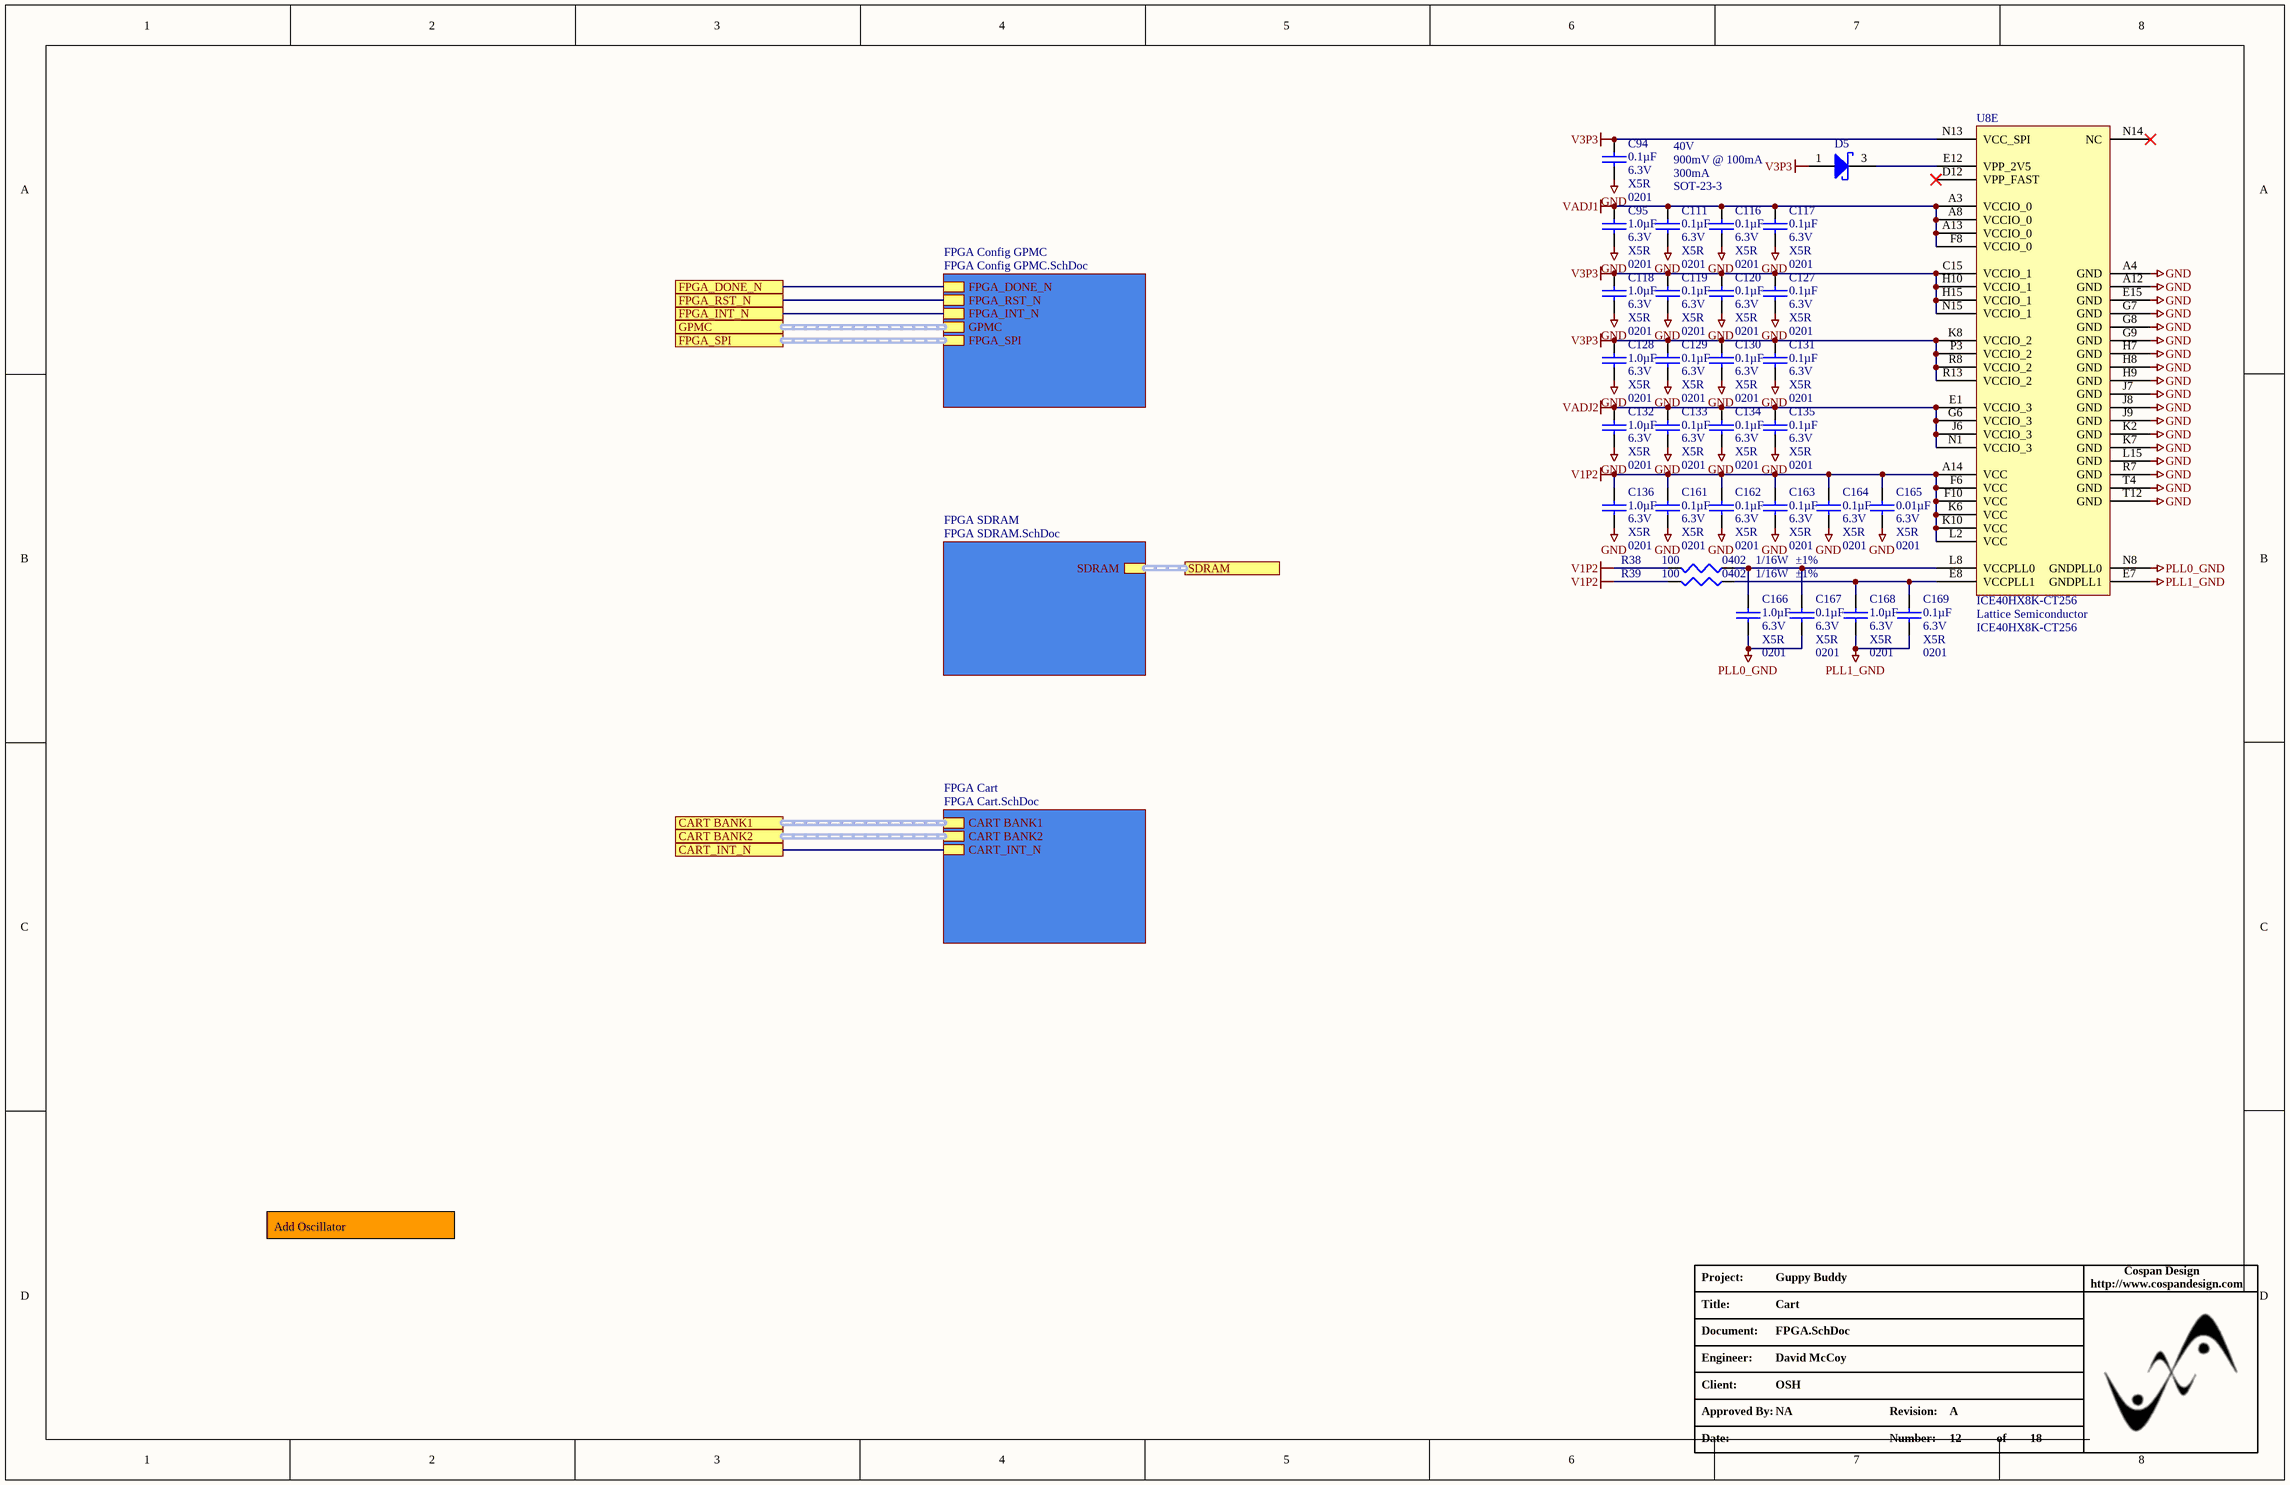
[diagram p16: FPGA.SchDoc]

### Parts
C94  Capacitance: 0.1µF  Voltage - Rated: 6.3V  Temperature Coefficient: X5R  Package / Case: 0201  [CAPC0201]  (hidden comment: 0.1UF)
C95  Capacitance: 1.0µF  Voltage - Rated: 6.3V  Temperature Coefficient: X5R  Package / Case: 0201  [CAPC0201]  (hidden comment: 1.0UF)
C111  Capacitance: 0.1µF  Voltage - Rated: 6.3V  Temperature Coefficient: X5R  Package / Case: 0201  [CAPC0201]  (hidden comment: 0.1UF)
C116  Capacitance: 0.1µF  Voltage - Rated: 6.3V  Temperature Coefficient: X5R  Package / Case: 0201  [CAPC0201]  (hidden comment: 0.1UF)
C117  Capacitance: 0.1µF  Voltage - Rated: 6.3V  Temperature Coefficient: X5R  Package / Case: 0201  [CAPC0201]  (hidden comment: 0.1UF)
C118  Capacitance: 1.0µF  Voltage - Rated: 6.3V  Temperature Coefficient: X5R  Package / Case: 0201  [CAPC0201]  (hidden comment: 1.0UF)
C119  Capacitance: 0.1µF  Voltage - Rated: 6.3V  Temperature Coefficient: X5R  Package / Case: 0201  [CAPC0201]  (hidden comment: 0.1UF)
C120  Capacitance: 0.1µF  Voltage - Rated: 6.3V  Temperature Coefficient: X5R  Package / Case: 0201  [CAPC0201]  (hidden comment: 0.1UF)
C127  Capacitance: 0.1µF  Voltage - Rated: 6.3V  Temperature Coefficient: X5R  Package / Case: 0201  [CAPC0201]  (hidden comment: 0.1UF)
C128  Capacitance: 1.0µF  Voltage - Rated: 6.3V  Temperature Coefficient: X5R  Package / Case: 0201  [CAPC0201]  (hidden comment: 1.0UF)
C129  Capacitance: 0.1µF  Voltage - Rated: 6.3V  Temperature Coefficient: X5R  Package / Case: 0201  [CAPC0201]  (hidden comment: 0.1UF)
C130  Capacitance: 0.1µF  Voltage - Rated: 6.3V  Temperature Coefficient: X5R  Package / Case: 0201  [CAPC0201]  (hidden comment: 0.1UF)
C131  Capacitance: 0.1µF  Voltage - Rated: 6.3V  Temperature Coefficient: X5R  Package / Case: 0201  [CAPC0201]  (hidden comment: 0.1UF)
C132  Capacitance: 1.0µF  Voltage - Rated: 6.3V  Temperature Coefficient: X5R  Package / Case: 0201  [CAPC0201]  (hidden comment: 1.0UF)
C133  Capacitance: 0.1µF  Voltage - Rated: 6.3V  Temperature Coefficient: X5R  Package / Case: 0201  [CAPC0201]  (hidden comment: 0.1UF)
C134  Capacitance: 0.1µF  Voltage - Rated: 6.3V  Temperature Coefficient: X5R  Package / Case: 0201  [CAPC0201]  (hidden comment: 0.1UF)
C135  Capacitance: 0.1µF  Voltage - Rated: 6.3V  Temperature Coefficient: X5R  Package / Case: 0201  [CAPC0201]  (hidden comment: 0.1UF)
C136  Capacitance: 1.0µF  Voltage - Rated: 6.3V  Temperature Coefficient: X5R  Package / Case: 0201  [CAPC0201]  (hidden comment: 1.0UF)
C161  Capacitance: 0.1µF  Voltage - Rated: 6.3V  Temperature Coefficient: X5R  Package / Case: 0201  [CAPC0201]  (hidden comment: 0.1UF)
C162  Capacitance: 0.1µF  Voltage - Rated: 6.3V  Temperature Coefficient: X5R  Package / Case: 0201  [CAPC0201]  (hidden comment: 0.1UF)
C163  Capacitance: 0.1µF  Voltage - Rated: 6.3V  Temperature Coefficient: X5R  Package / Case: 0201  [CAPC0201]  (hidden comment: 0.1UF)
C164  Capacitance: 0.1µF  Voltage - Rated: 6.3V  Temperature Coefficient: X5R  Package / Case: 0201  [CAPC0201]  (hidden comment: 0.1UF)
C165  Capacitance: 0.01µF  Voltage - Rated: 6.3V  Temperature Coefficient: X5R  Package / Case: 0201  [CAPC0201]  (hidden comment: 0.01UF)
C166  Capacitance: 1.0µF  Voltage - Rated: 6.3V  Temperature Coefficient: X5R  Package / Case: 0201  [CAPC0201]  (hidden comment: 1.0UF)
C167  Capacitance: 0.1µF  Voltage - Rated: 6.3V  Temperature Coefficient: X5R  Package / Case: 0201  [CAPC0201]  (hidden comment: 0.1UF)
C168  Capacitance: 1.0µF  Voltage - Rated: 6.3V  Temperature Coefficient: X5R  Package / Case: 0201  [CAPC0201]  (hidden comment: 1.0UF)
C169  Capacitance: 0.1µF  Voltage - Rated: 6.3V  Temperature Coefficient: X5R  Package / Case: 0201  [CAPC0201]  (hidden comment: 0.1UF)
D5  Voltage - DC Reverse (Vr) (Max): 40V  Voltage - Forward (Vf) (Max) @ If: 900mV @ 100mA  Current - Average Rectified (Io): 300mA  Package / Case: SOT-23-3  [SOT23]  (hidden comment: BAT54)
R38  Case: 0402  Resistance In Ohms: 100  Power (Watts): 1/16W  Tolerance: ±1%  [R_0402]  (hidden comment: R_0402_100.0)
R39  Case: 0402  Resistance In Ohms: 100  Power (Watts): 1/16W  Tolerance: ±1%  [R_0402]  (hidden comment: R_0402_100.0)
U8  ICE40HX8K-CT256  Manufacturer 1: Lattice Semiconductor  [LATC-caBGA-256]  (part E of 5)

### Sub-sheets
FPGA Cart = FPGA Cart.SchDoc: CART BANK2 (harness CART BANK2 Harness), CART_INT_N, CART BANK1 (harness CART BANK1 Harness)
FPGA Config GPMC = FPGA Config GPMC.SchDoc: FPGA_DONE_N, FPGA_RST_N, GPMC (harness GPMC Harness), FPGA_SPI (harness SPI Harness), FPGA_INT_N
FPGA SDRAM = FPGA SDRAM.SchDoc: SDRAM (harness SDRAM Harness)

### Ports
CART BANK1 (harness CART BANK1 Harness), CART BANK2 (harness CART BANK2 Harness), CART_INT_N, FPGA_DONE_N, FPGA_INT_N, FPGA_RST_N, FPGA_SPI (harness SPI Harness), GPMC (harness GPMC Harness), SDRAM (harness SDRAM Harness)

### Nets
GND: C94.1 C95.1 C111.1 C116.1 C117.1 C118.1 C119.1 C120.1 C127.1 C128.1 C129.1 C130.1 C131.1 C132.1 C133.1 C134.1 C135.1 C136.1 C161.1 C162.1 C163.1 C164.1 C165.1 U8.A4(GND) U8.A12(GND) U8.E15(GND) U8.G7(GND) U8.G8(GND) U8.G9(GND) U8.H7(GND) U8.H8(GND) U8.H9(GND) U8.J7(GND) U8.J8(GND) U8.J9(GND) U8.K2(GND) U8.K7(GND) U8.L15(GND) U8.R7(GND) U8.T4(GND) U8.T12(GND)
PLL0_GND: C166.1 C167.1 U8.N8(GNDPLL0)
PLL1_GND: C168.1 C169.1 U8.E7(GNDPLL1)
V1P2: C136.2 C161.2 C162.2 C163.2 C164.2 C165.2 R38.1 R39.1 U8.A14(VCC) U8.F6(VCC) U8.F10(VCC) U8.K6(VCC) U8.K10(VCC) U8.L2(VCC)
V3P3: C94.2 C118.2 C119.2 C120.2 C127.2 C128.2 C129.2 C130.2 C131.2 D5.1(A) U8.C15(VCCIO_1) U8.H10(VCCIO_1) U8.H15(VCCIO_1) U8.K8(VCCIO_2) U8.N13(VCC_SPI) U8.N15(VCCIO_1) U8.P3(VCCIO_2) U8.R8(VCCIO_2) U8.R13(VCCIO_2)
VADJ1: C95.2 C111.2 C116.2 C117.2 U8.A3(VCCIO_0) U8.A8(VCCIO_0) U8.A13(VCCIO_0) U8.F8(VCCIO_0)
VADJ2: C132.2 C133.2 C134.2 C135.2 U8.E1(VCCIO_3) U8.G6(VCCIO_3) U8.J6(VCCIO_3) U8.N1(VCCIO_3)
CART_INT_N: port CART_INT_N, sheet FPGA Cart/CART_INT_N
FPGA_DONE_N: port FPGA_DONE_N, sheet FPGA Config GPMC/FPGA_DONE_N
FPGA_INT_N: port FPGA_INT_N, sheet FPGA Config GPMC/FPGA_INT_N
FPGA_RST_N: port FPGA_RST_N, sheet FPGA Config GPMC/FPGA_RST_N
NetC166_2: C166.2 C167.2 R38.2 U8.L8(VCCPLL0)
NetC168_2: C168.2 C169.2 R39.2 U8.E8(VCCPLL1)
NetD5_3: D5.3(K) U8.E12(VPP_2V5)

Not connected (* = marked no-connect by the designer): U8 D12(VPP_FAST)* N14(NC)*

### Buses and harness runs
harness port CART BANK1 = sheet FPGA Cart/CART BANK1
harness port CART BANK2 = sheet FPGA Cart/CART BANK2
harness port FPGA_SPI = sheet FPGA Config GPMC/FPGA_SPI
harness port GPMC = sheet FPGA Config GPMC/GPMC
harness port SDRAM = sheet FPGA SDRAM/SDRAM

### Notes on the sheet
- Add Oscillator
- Project:
- http://www.cospandesign.com
- Cospan Design
- Document:
- Engineer:
- Title:
- Client:
- Approved By:
- Revision:
- Date:
- Number:
- of

### Library data of the parts
C94 C111 C116 C117 C119 C120 C127 C129-C131 C133-C135 C161-C164 C167 C169 = C_0201_0.1UF: CAP CER 0.1UF 6.3V 10% X5R 0201; Manufacturer: Murata Electronics North America; Manufacturer Part Number: GRM033R60J104KE19D; Supplier 1: Digi-Key; RoHS: RoHS Compliant; Category: Capacitors; Stock 1: 13375857; Pricing 1: 1=0.1, 10=0.033, 100=0.0149, 500=0.01062, 1000=0.00835, 2500=0.00759, 5000=0.00698 (USD); Packaging: Cut Tape (CT); Part Status: Active; Tolerance: ±10%; Operating Temperature: -55°C ~ 85°C; Features: -; Ratings: -; Applications: General Purpose; Mounting Type: Surface Mount, MLCC; Size / Dimension: 0.024" L x 0.012" W (0.60mm x 0.30mm); Height - Seated (Max): -; Thickness (Max): 0.013" (0.33mm); Lead Spacing: -; Lead Style: -; ComponentLink1URL: http://search.murata.co.jp/Ceramy/image/img/A01X/G101/ENG/GRM033R60J104KE19-01.pdf; ComponentLink1Description: http://search.murata.co.jp/Ceramy/image/img/A01X/G101/ENG/GRM033R60J104KE19-01.pdf; Supplier Part Number 1: 490-3167-1-ND
C95 C118 C128 C132 C136 C166 C168 = C_0201_1.0UF: CAP CER 1UF 6.3V 20% X5R 0201; Manufacturer: AVX; Manufacturer Part Number: 02016D105KAT2A; Tolerance: 10 %; Voltage Rating: 6.3 Volts; Product Status: New at Mouser; Supplier 1: Mouser; Supplier Part Number 1: 581-02016D105KAT2A; RoHS: RoHS Compliant; Category: Multilayer Ceramic Capacitors (MLCC) - SMD/SMT; Stock 1: 9875; Pricing: 1=0.878, 50=0.635, 100=0.394, 500=0.274, 1000=0.257, 15000=0.224 (AUD); Dimensions: 0.3 mm W x 0.6 mm L x 0.33 mm H; Operating Temperature Range: - 55 C to + 85 C; Packaging: Reel; Product: General Type MLCCs; Series: CX5R; Termination Style: SMD/SMT; Product Category: SMD Ceramic Capacitors; Temperature Coefficient / Code: X5R; RoHS - Mouser: Y; Minimum Order Quantity: 1; Reeling: True; ComponentLink1URL: http://www.avx.com/docs/Catalogs/cx5r.pdf; ComponentLink1Description: http://www.avx.com/docs/Catalogs/cx5r.pdf
C165 = C_0201_0.01UF: CAP CER 10000PF 6.3V X5R 0201; Manufacturer: TDK Corporation; Manufacturer Part Number: C0603X5R0J103M; Tolerance: ±20%; Supplier 1: Digi-Key; Supplier Part Number 1: 445-4704-1-ND; RoHS: RoHS Compliant; Category: Capacitors; Stock 1: 31876; Pricing: 1=0.08, 10=0.05, 100=0.018, 250=0.013, 500=0.0096, 1000=0.0065 (USD); Mounting Type: Surface Mount, MLCC; Operating Temperature: -55°C ~ 85°C; Applications: General Purpose; Ratings: -; Size / Dimension: 0.024" L x 0.012" W (0.60mm x 0.30mm); Height - Seated (Max): -; Thickness (Max): 0.013" (0.33mm); Lead Spacing: -; Features: -; Packaging: Cut Tape (CT); Lead Style: -; ComponentLink1URL: http://www.tdk.com/pdf/general_B11.pdf; ComponentLink1Description: http://www.tdk.com/pdf/general_B11.pdf
D5 = D_SCHOTT_BAT54WFILM: DIODE SCHOTTKY 40V 300MA SOT-23; Manufacturer 1: STMicroelectronics; Description 1: DIODE SCHOTTKY 40V 300MA SOT323; Forward Voltage: 900mV; Max Surge Current: 1A; Recovery Time: 5ns; Peak Reverse Current: 1uA; Element Configuration: Single; Polarity: Standard; Voltage Rating (DC): 30V; Capacitance: 10pF; ComponentLink1URL: http://www.fairchildsemi.com/ds/BA/BAT54.pdf; ComponentLink1Description: http://www.fairchildsemi.com/ds/BA/BAT54.pdf; Supplier 1: Digi-Key; Supplier Part Number 1: 497-2530-6-ND; Stock 1: 16371; Pricing 1: 1=0.38, 10=0.286, 100=0.1617, 500=0.10706, 1000=0.08209 (USD); Mount: Surface Mount; Case/Package: SOT-323; Number of Pins: 3; Min Operating Temperature: -40°C; Max Operating Temperature: 150°C; Package Quantity: 1; Packaging: Tape and Reel; Forward Current: 300mA; Max Reverse Leakage Current: 1uA; Average Rectified Current: 300mA; Reverse Recovery Time: 5ns; Max Repetitive Reverse Voltage (Vrrm): 40V; Peak Non-Repetitive Surge Current: 1A; Max Forward Surge Current (Ifsm): 1A; Current Rating: 300mA; Output Current: 300mA; Max Reverse Voltage (DC): 40V; Length: 2mm; Height: 1.1mm; Width: 1.25mm; Radiation Hardening: No; Lead Free: Lead Free; ComponentLink2URL: https://datasheet.ciiva.com/4714/cd00001322-105648-4714481.pdf; ComponentLink2Description: https://datasheet.ciiva.com/4714/cd00001322-105648-4714481.pdf; ComponentLink3URL: https://datasheet.ciiva.com/15144/getdatasheetpartid-39206-15144069.pdf; ComponentLink3Description: https://datasheet.ciiva.com/15144/getdatasheetpartid-39206-15144069.pdf; ComponentLink4URL: https://datasheet.ciiva.com/915/cd00001322-915500.pdf; ComponentLink4Description: https://datasheet.ciiva.com/915/cd00001322-915500.pdf; ComponentLink5URL: https://datasheet.ciiva.com/915/cd00001322-915501.pdf; ComponentLink5Description: https://datasheet.ciiva.com/915/cd00001322-915501.pdf; ComponentLink6URL: https://datasheet.ciiva.com/915/cd00001322-915502.pdf; ComponentLink6Description: https://datasheet.ciiva.com/915/cd00001322-915502.pdf; Manufacturer Part Number 1: BAT54WFILM
R38 R39 = R_0402_100.0: RES 100 OHM 1/16W 1% 0402 SMD; Manufacturer: Yageo; Manufacturer Part Number: RC0402FR-07100RL; Temperature Coefficient: ±100ppm/°C; Supplier 1: Digi-Key; RoHS: RoHS Compliant; Category: Resistors; Stock 1: 2051645; Pricing 1: 1=0.1, 10=0.013, 25=0.0096, 100=0.0054, 250=0.00412, 500=0.00328, 1000=0.00242, 2500=0.0021, 5000=0.00173 (USD); Packaging: Cut Tape (CT); Resistance (Ohms): 100; Composition: Thick Film; Features: Moisture Resistant; Operating Temperature: -55°C ~ 155°C; Package / Case: 0402 (1005 Metric); Supplier Device Package: 0402; Size / Dimension: 0.039" L x 0.020" W (1.00mm x 0.50mm); Height: 0.016" (0.40mm); Number of Terminations: 2; ComponentLink1URL: http://www.yageo.com/documents/recent/PYu-RC_Group_51_RoHS_L_2.pdf; ComponentLink1Description: http://www.yageo.com/documents/recent/PYu-RC_Group_51_RoHS_L_2.pdf; Supplier Part Number 1: 311-100LRCT-ND
U8 = U_ICE40HX8K-CT256: iCE40 HX8K Series FPGA Family, 7680 Logic Cells, 1.2 V Core, 128 K Embedded RAM Bits, 256-ball caBGA, Pb-Free, Tray; Supply Voltage: 1.2V; Phase-Locked Loops: 2; Logic Cells: 7680; Embedded RAM Bits: 128K; Description 1: IC FPGA HX 7680LUTS 1.2V 256BGA; Density: 128Kb; Number of Logic Blocks (LABs): 960; Number of I/Os: 206; Min Supply Voltage: 1.14V; Max Supply Voltage: 1.26V; RAM Size: 131072b; Max Frequency: 533MHz; PackageReference: caBGA-256; PackageDescription: 256-Ball Chip Array Ball Grid Array, Body 14 x 14 mm, Pitch 0.8 mm; RoHS: TRUE; Packing: Tray; Mounting Technology: Surface Mount; ComponentLink3URL: http://www.latticesemi.com/lit/docs/package/pkg.pdf; ComponentLink1Description: Manufacturer URL; ComponentLink3Description: Package Specification; Code_JEDEC: MO-275; PackageVersion: Rev. 03.9, 02/2013; ComponentLink1URL: http://www.latticesemi.com/en; ComponentLink2URL: http://www.latticesemi.com/~/media/Documents/DataSheets/iCE/iCE40LPHXFamilyDataSheet.pdf; PartNumber: ICE40HX8K-CT256; Manufacturer: Lattice Semiconductor; ComponentLink2Description: Datasheet; DatasheetVersion: Rev. 02.9; Supplier 1: Digi-Key; Supplier Part Number 1: 220-1575-ND; Stock 1: 549; Pricing 1: 1=11.41, 25=9.898, 100=9.4536 (USD); Case/Package: BGA; Number of Pins: 256; Weight: 0.098203oz; Min Operating Temperature: -40°C; Max Operating Temperature: 85°C; Package Quantity: 119; Packaging: Tray; Operating Supply Voltage: 1.2V; Number of Gates: 7680; Number of Logic Elements/Cells: 7680; Memory Size: 128Kb; Number of Registers: 7680; Length: 14mm; Height: 17mm; Width: 14mm; Lead Free: Lead Free; ComponentLink4URL: http://www.mouser.com/ds/2/225/iCE40FamilyHandbook-311139.pdf; ComponentLink4Description: http://www.mouser.com/ds/2/225/iCE40FamilyHandbook-311139.pdf; Manufacturer Part Number 1: ICE40HX8K-CT256